# Altium schematic sheet 下载&调试.SchDoc
size A4
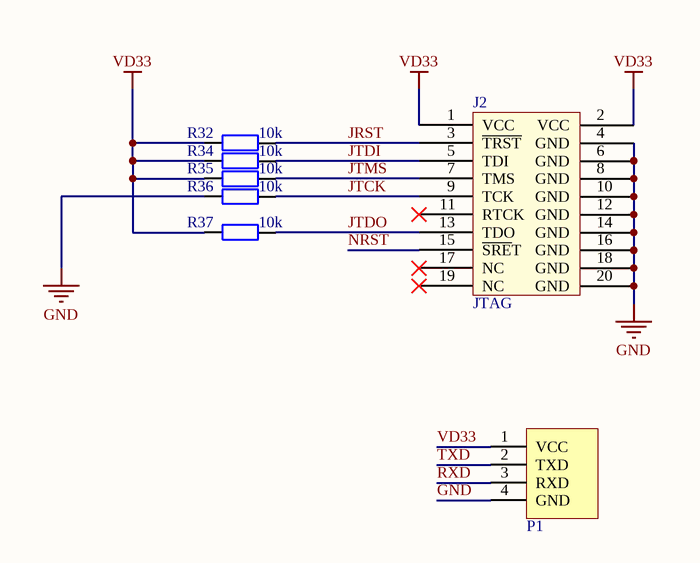
[diagram p0: 下载&调试.SchDoc]

## Parts
J2  JTAG  [JTAG_20]
P1  UART  [�������ؽӿ�]  (value not drawn)
R32  10k  [LC-0805_R]
R34  10k  [LC-0805_R]
R35  10k  [LC-0805_R]
R36  10k  [LC-0805_R]
R37  10k  [LC-0805_R]

## Nets
GND: J2.4(GND) J2.6(GND) J2.8(GND) J2.10(GND) J2.12(GND) J2.14(GND) J2.16(GND) J2.18(GND) J2.20(GND) P1.4(GND) R36.1
VD33: J2.1(VCC) J2.2(VCC) P1.1(VCC) R32.1 R34.1 R35.1 R37.1
JRST: J2.3(~{TRST}) R32.2
JTCK: J2.9(TCK) R36.2
JTDI: J2.5(TDI) R34.2
JTDO: J2.13(TDO) R37.2
JTMS: J2.7(TMS) R35.2
NRST: J2.15(~{SRE}T)
RXD: P1.3(RXD)
TXD: P1.2(TXD)

Not connected (* = marked no-connect by the designer): J2 11(RTCK)* 17(NC)* 19(NC)*

## Library data of the parts
J2 = JTAG: 2*10Pin,Jtag����
R32 R34-R37 = R: 10k��,0805,��5%